# Altium schematic sheet Control_Sense.SchDoc
size A2 portrait; SheetNumber: 2; SheetTotal: 2
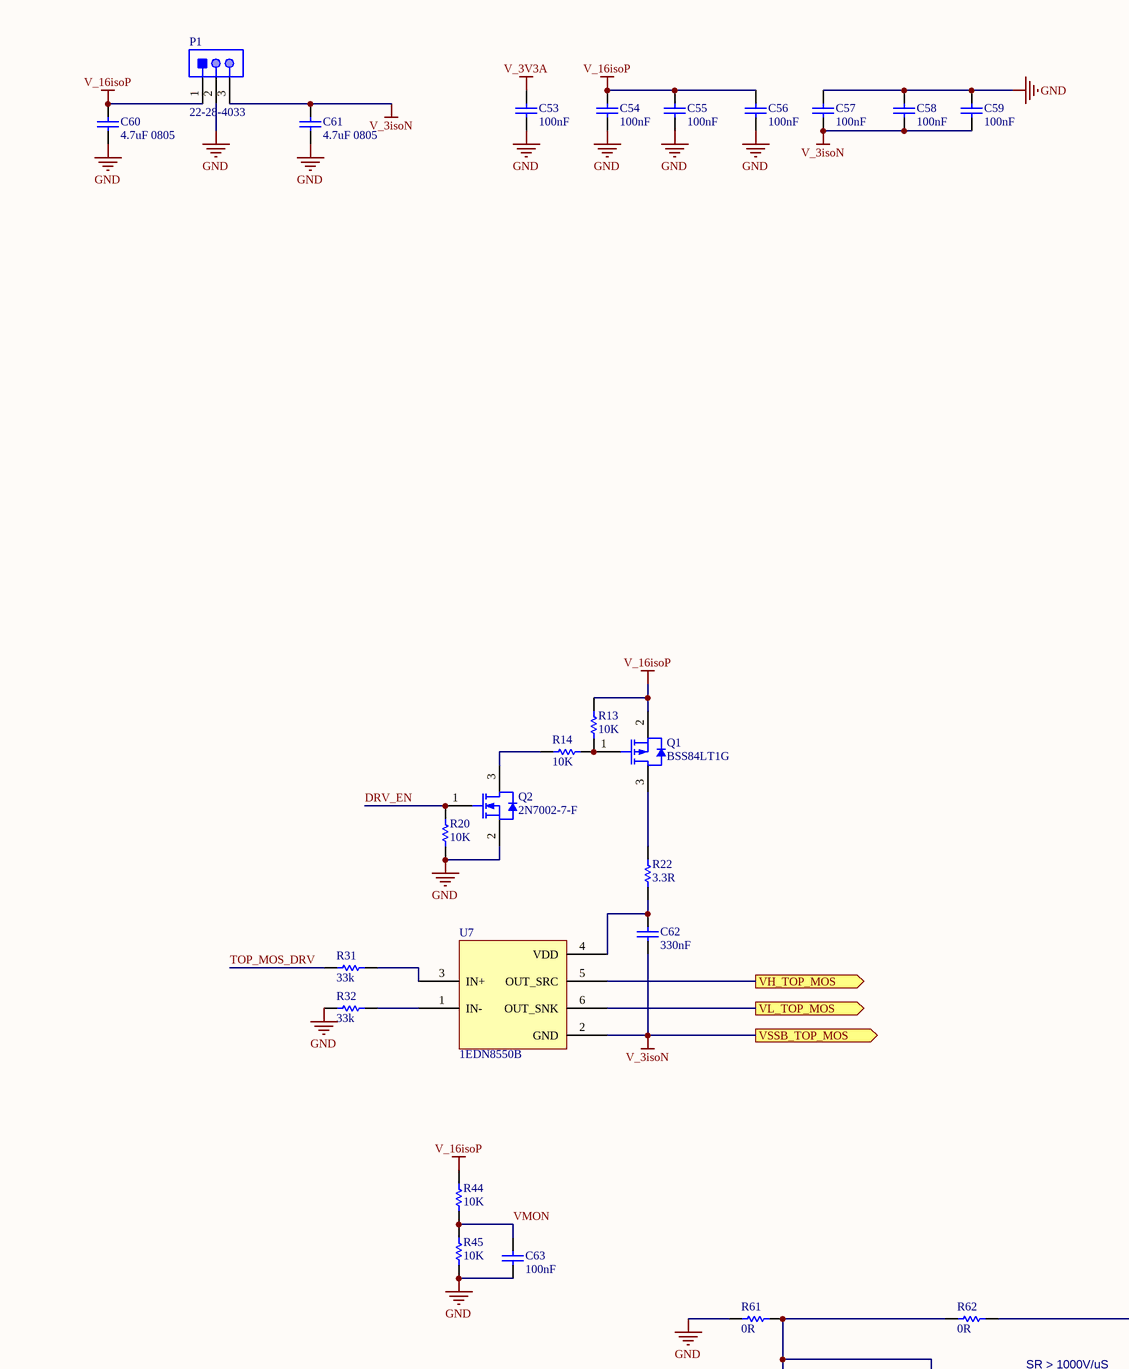
[diagram p0: Control_Sense.SchDoc, top]
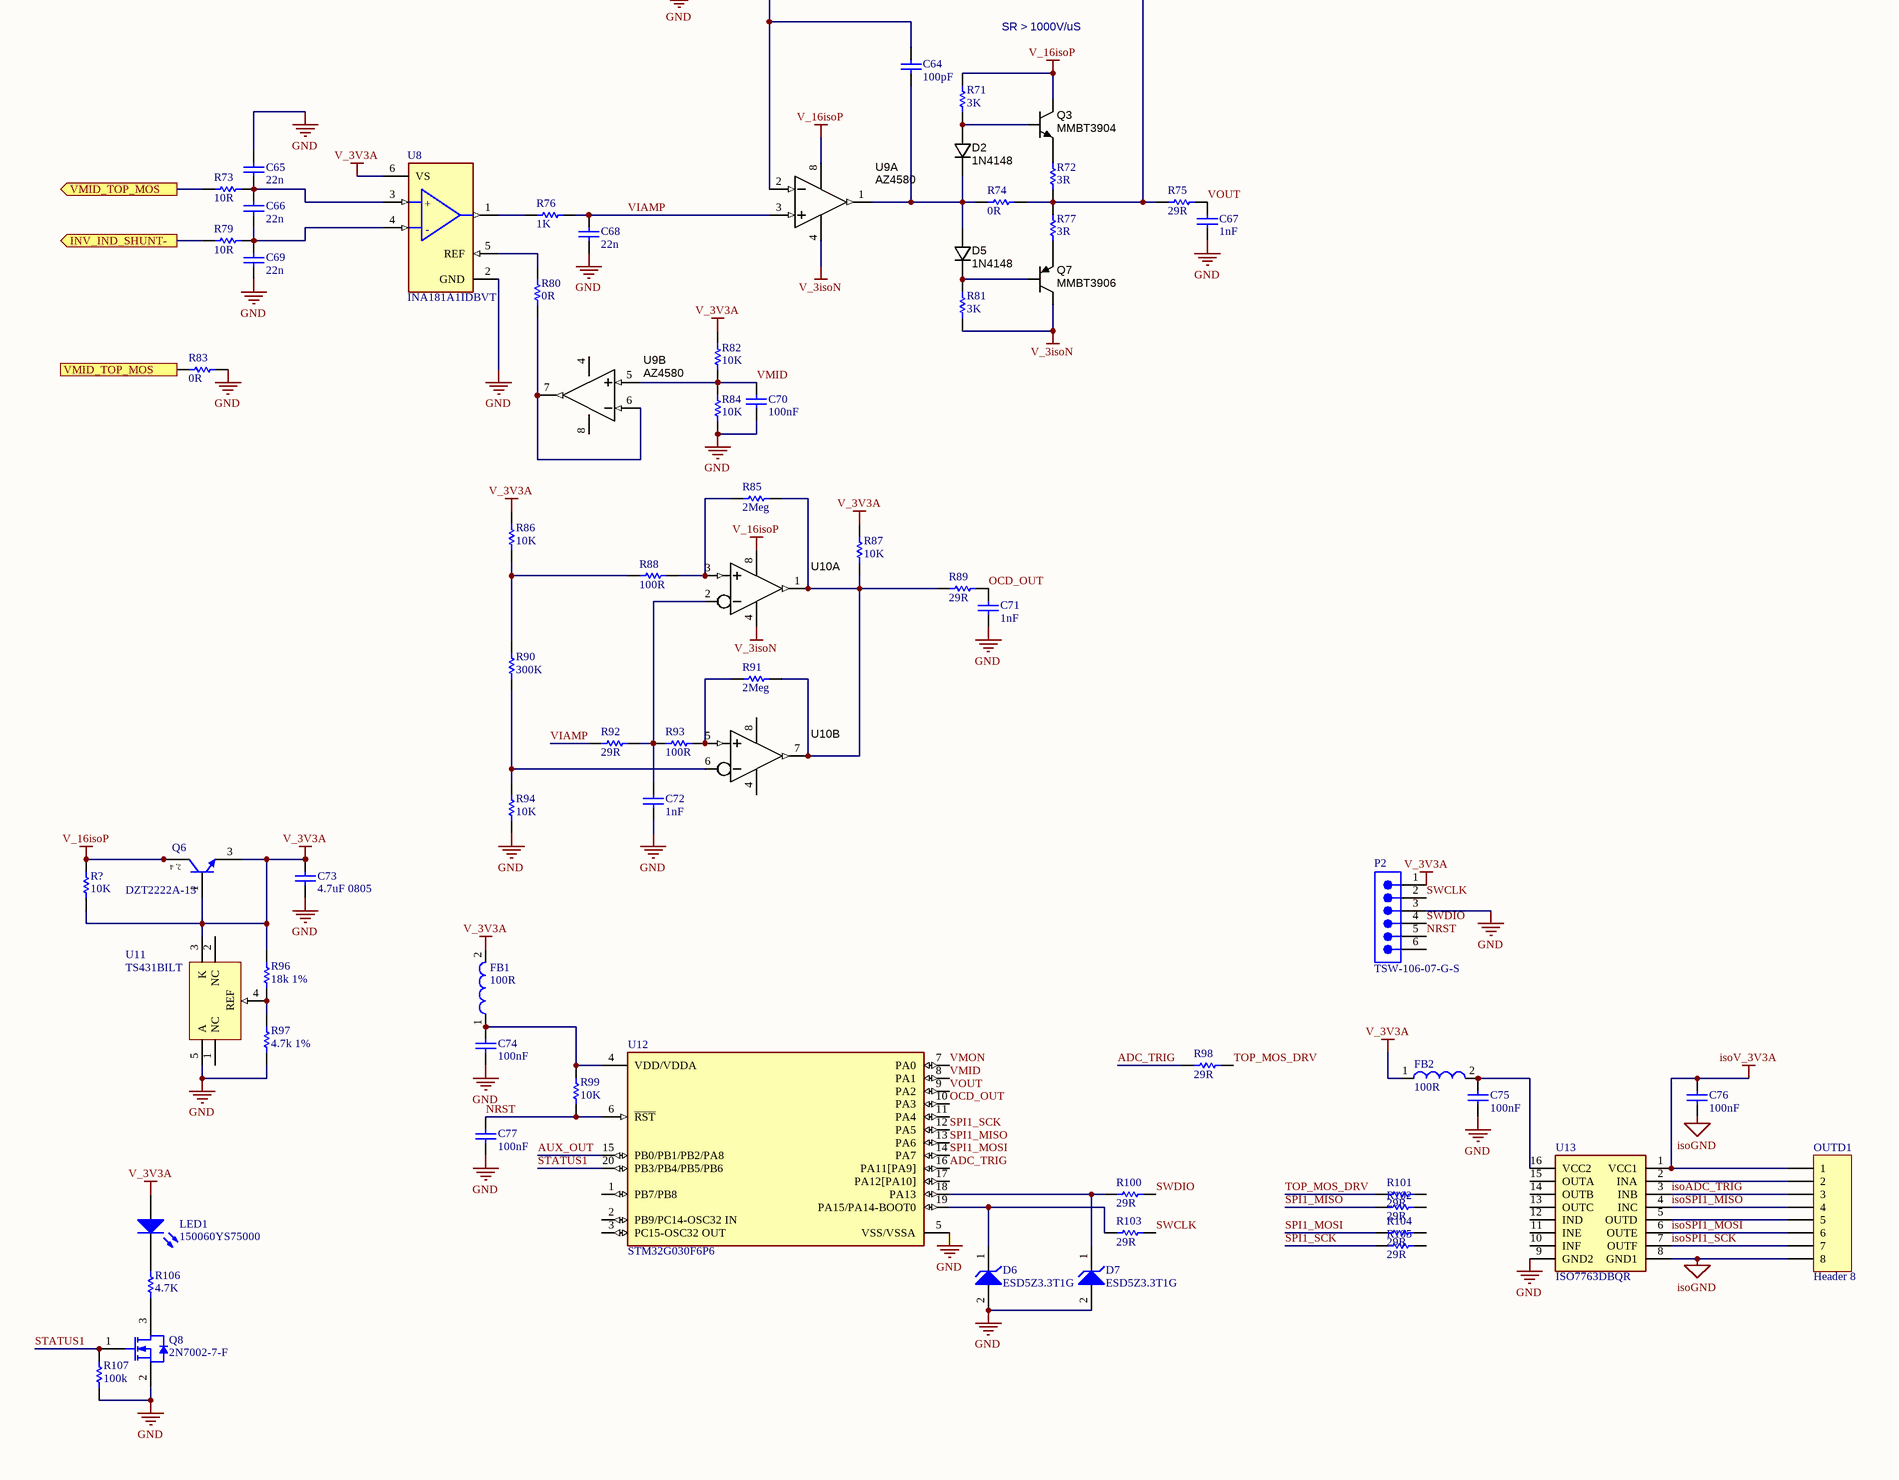
[diagram p1: Control_Sense.SchDoc, bottom]

## Parts
C53  100nF  [CAPC1608X90X35ML15T15]
C54  100nF  [CAPC1608X90X35ML15T15]
C55  100nF  [CAPC1608X90X35ML15T15]
C56  100nF  [CAPC1608X90X35NL15T15]
C57  100nF  [CAPC1608X90X35ML15T15]
C58  100nF  [CAPC1608X90X35ML15T15]
C59  100nF  [CAPC1608X90X35NL15T15]
C60  4.7uF 0805  [CAPC2013X145X20NL20]
C61  4.7uF 0805  [CAPC2013X145X20NL20]
C62  330nF  [CAPC2013X135X45ML10T25]
C63  100nF  [CAPC1608X90X35ML15T15]
C64  100pF  [CAPC1608X90X35ML15T15]
C65  22n  [CAPC2013X135X45ML10T25]
C66  22n  [CAPC2013X135X45ML10T25]
C67  1nF  [CAPC1608X90X35NL15T15]
C68  22n  [CAPC2013X135X45ML10T25]
C69  22n  [CAPC2013X135X45ML10T25]
C70  100nF  [CAPC1608X90X35ML15T15]
C71  1nF  [CAPC1608X90X35NL15T15]
C72  1nF  [CAPC1608X90X35NL15T15]
C73  4.7uF 0805  [CAPC2013X145X20NL20]
C74  100nF  [CAPC1608X90X35NL15T15]
C75  100nF  [CAPC1608X90X35NL15T15]
C76  100nF  [CAPC1608X90X35NL15T15]
C77  100nF  [CAPC1608X90X35NL15T15]
D2  Manufacturer Part Number: 1N4148  [SOD323]  (hidden comment: DIODE_75V_500mW)
D5  Manufacturer Part Number: 1N4148  [SOD323]  (hidden comment: DIODE_75V_500mW)
D6  ESD5Z3.3T1G  [ONSC-SOD-523-2-502-01_V]
D7  ESD5Z3.3T1G  [ONSC-SOD-523-2-502-01_V]
FB1  100R  [SMD-0603]
FB2  100R  [SMD-0603]
LED1  150060YS75000  [0603_A]
OUTD1  Header 8  [HDR1X8]
P1  22-28-4033  [MOLX-22-28-4033_V]
P2  TSW-106-07-G-S  [SMTC-TSW-106-07-X-S]
Q1  BSS84LT1G  [ONSC-SOT-23-3-318-08_V]
Q2  2N7002-7-F  [DIOD-SOT23-3_V]
Q3  Manufacturer Part Number 1: MMBT3904  [SOT23-3]  (hidden comment: NPN_MMBT3904)
Q6  DZT2222A-13  [ONSC-SOT-223-4-318E-04_V]
Q7  Manufacturer Part Number 1: MMBT3906  [SOT23-3]  (hidden comment: PNP_MMBT3906)
Q8  2N7002-7-F  [DIOD-SOT23-3_V]
R13  10K  [RESC1608X55X30NL20T10]
R14  10K  [RESC1608X55X30NL20T10]
R20  10K  [RESC1608X55X30NL20T10]
R22  3.3R  [RESC1608X55X25ML10T15]
R31  33k  [RESC1608X55X25ML10T15]
R32  33k  [RESC1608X55X25ML10T15]
R44  10K  [RESC1608X55X30NL20T10]
R45  10K  [RESC1608X55X30NL20T10]
R61  0R  [RESC1608X55X30NL20T10]
R62  0R  [RESC1608X55X30NL20T10]
R71  3K  [RESC1608X55X30NL20T10]
R72  3R  [RESC1608X55X30NL20T10]
R73  10R  [RESC1608X55X30NL20T10]
R74  0R  [RESC1608X55X30NL20T10]
R75  29R  [RESC1608X55X30NL20T10]
R76  1K  [RESC1608X55X30NL20T10]
R77  3R  [RESC1608X55X30NL20T10]
R79  10R  [RESC1608X55X30NL20T10]
R80  0R  [RESC1608X55X30NL20T10]
R81  3K  [RESC1608X55X30NL20T10]
R82  10K  [RESC1608X55X30NL20T10]
R83  0R  [RESC1608X55X30NL20T10]
R84  10K  [RESC1608X55X30NL20T10]
R85  2Meg  [RESC1608X55X30NL20T10]
R86  10K  [RESC1608X55X30NL20T10]
R87  10K  [RESC1608X55X30NL20T10]
R88  100R  [RESC1608X55X30NL20T10]
R89  29R  [RESC1608X55X30NL20T10]
R90  300K  [RESC1608X55X30NL20T10]
R91  2Meg  [RESC1608X55X30NL20T10]
R92  29R  [RESC1608X55X30NL20T10]
R93  100R  [RESC1608X55X30NL20T10]
R94  10K  [RESC1608X55X30NL20T10]
R96  18k 1%  [RESC1609X55X30NL15T15]
R97  4.7k 1%  [RESC1608X55X30NL15T15]
R98  29R  [RESC1608X55X30NL20T10]
R99  10K  [RESC1608X55X30NL20T10]
R100  29R  [RESC1608X55X30NL20T10]
R101  29R  [RESC1608X55X30NL20T10]
R102  29R  [RESC1608X55X30NL20T10]
R103  29R  [RESC1608X55X30NL20T10]
R104  29R  [RESC1608X55X30NL20T10]
R105  29R  [RESC1608X55X30NL20T10]
R106  4.7K  [RESC1608X55X25ML10T15]
R107  100k  [RESC1608X55X25ML10T15]
R?  10K  [RESC1608X55X30NL20T10]
U7  1EDN8550B  [SOT23-6]
U8  INA181A1IDBVT  [FP-DBV0006A-MFG]
U9  AZ4580  [SOIC127P600X175-8AN]  (parts A,B of 2)
U10  LMC6762  [SOIC127P600X175-8AN]  (value not drawn)  (parts A,B of 2)
U11  TS431BILT  [SOT23-5_N]
U12  STM32G030F6P6  [FP-TSSOP20-YA-MFG]
U13  ISO7763DBQR  [SOP64P600X175-16N]

## Ports
INV_IND_SHUNT- (out), VH_TOP_MOS (out), VL_TOP_MOS (out), VMID_TOP_MOS (out), VSSB_TOP_MOS (out)

## Nets
GND: C53.1 C54.1 C55.1 C56.1 C57.2 C58.2 C59.2 C60.1 C61.1 C63.1 C65.2 C67.1 C68.1 C69.1 C70.1 C71.1 C72.1 C73.1 C74.1 C75.1 C77.1 D6.2(A) D7.2(A) P1.2 P2.3 Q2.2(S) Q8.2(S) R20.2 R32.1 R45.2 R61.1 R83.1 R84.2 R94.1 R97.1 R107.1 U8.2(GND) U11.5(A) U12.5(VSS/VSSA) U13.9(GND2)
isoGND: C76.1 OUTD1.8 U13.8(GND1)
isoV_3V3A: C76.2 OUTD1.1 U13.1(VCC1)
V_3isoN: C57.1 C58.1 C59.1 C61.2 C62.1 P1.3 Q7.3(C) R81.2 U7.2(GND) U9.4(V-) U10.4(V-) ; port VSSB_TOP_MOS
V_3V3A: C53.2 C73.2 FB1.2 FB2.1 LED1.2(A) P2.1 Q6.1(B) Q6.3(E) R82.1 R86.2 R87.1 R96.2 R?.1 U8.6(VS) U11.3(K)
V_16isoP: C54.2 C55.2 C56.2 C60.2 P1.1 Q1.2(S) Q3.3(C) Q6.2(C) Q6.4(C) R13.1 R44.1 R71.1 R?.2 U9.8(V+) U10.8(V+)
ADC_TRIG: R98.1 U12.16(PA11[PA9])
AUX_OUT: U12.15(PB0/PB1/PB2/PA8)
DRV_EN: Q2.1(G) R20.1
INV_IND_SHUNT-: R79.2 ; port INV_IND_SHUNT-
isoADC_TRIG: OUTD1.3 U13.3(INB)
isoSPI1_MISO: OUTD1.4 U13.4(INC)
isoSPI1_MOSI: OUTD1.6 U13.6(OUTE)
isoSPI1_SCK: OUTD1.7 U13.7(OUTF)
NRST: C77.2 P2.5 R99.2 U12.6(~{RST})
OCD_OUT: C71.2 R89.2 U12.10(PA3)
SPI1_MISO: R102.1 U12.13(PA6)
SPI1_MOSI: R104.1 U12.14(PA7)
SPI1_SCK: R105.1 U12.12(PA5)
STATUS1: Q8.1(G) R107.2 U12.20(PB3/PB4/PB5/PB6)
SWCLK: P2.2 R103.2
SWDIO: P2.4 R100.2
TOP_MOS_DRV: R31.1 R98.2 R101.1
VH_TOP_MOS: U7.5(OUT_SRC) ; port VH_TOP_MOS
VIAMP: C68.2 R76.2 R92.1 U9.3(IN+)
VL_TOP_MOS: U7.6(OUT_SNK) ; port VL_TOP_MOS
VMID: C70.2 R82.2 R84.1 U9.5(IN+) U12.8(PA1)
VMID_TOP_MOS: R73.2 R83.2 ; port VMID_TOP_MOS
VMON: C63.2 R44.2 R45.1 U12.7(PA0)
VOUT: C67.2 R75.2 U12.9(PA2)
NetC62_2: C62.2 R22.1 U7.4(VDD)
NetC64_1: C64.1 D2.K D5.A R74.1 U9.1(OUT)
NetC64_2: C64.2 R61.2 R62.1 U9.2(IN-)
NetC65_1: C65.1 C66.2 R73.1 U8.3(IN+)
NetC66_1: C66.1 C69.2 R79.1 U8.4(IN-)
NetC72_2: C72.2 R92.2 R93.1 U10.2(IN_A-)
NetC74_2: C74.2 FB1.1 R99.1 U12.4(VDD/VDDA)
NetC75_2: C75.2 FB2.2 U13.16(VCC2)
NetD2_A: D2.A Q3.1(B) R71.2
NetD5_K: D5.K Q7.1(B) R81.1
NetD6_1: D6.1(K) R103.1 U12.19(PA15/PA14-BOOT0)
NetD7_1: D7.1(K) R100.1 U12.18(PA13)
NetLED1_1: LED1.1(K) R106.2
NetOUTD1_2: OUTD1.2 U13.2(INA)
NetOUTD1_5: OUTD1.5 U13.5(OUTD)
NetQ1_1: Q1.1(G) R13.2 R14.2
NetQ1_3: Q1.3(D) R22.2
NetQ2_3: Q2.3(D) R14.1
NetQ3_2: Q3.2(E) R72.1
NetQ7_2: Q7.2(E) R77.2
NetQ8_3: Q8.3(D) R106.1
NetR31_2: R31.2 U7.3(IN+)
NetR32_2: R32.2 U7.1(IN-)
NetR62_2: R62.2 R72.2 R74.2 R75.1 R77.1
NetR76_1: R76.1 U8.1(OUT)
NetR80_1: R80.1 U8.5(REF)
NetR80_2: R80.2 U9.6(IN-) U9.7(OUT)
NetR85_1: R85.1 R88.2 U10.3(IN_A+)
NetR85_2: R85.2 R87.2 R89.1 R91.2 U10.1(OUT_A) U10.7(OUT_B)
NetR86_1: R86.1 R88.1 R90.2
NetR90_1: R90.1 R94.2 U10.6(IN_B-)
NetR91_1: R91.1 R93.2 U10.5(IN_B+)
NetR96_1: R96.1 R97.2 U11.4(REF)

Not connected (* = marked no-connect by the designer): P2 6; R101 2; R102 2; R104 2; R105 2; U11 1(NC) 2(NC); U12 1(PB7/PB8) 2(PB9/PC14-OSC32_IN) 3(PC15-OSC32_OUT) 11(PA4) 17(PA12[PA10]); U13 10(INF) 11(INE) 12(IND) 13(OUTC) 14(OUTB) 15(OUTA)

## Notes on the sheet
- SR > 1000V/uS
- (in symbol CMP-1048-00517-1) 2, 4
- (in symbol CMP-04895-000046-1) +; -

## Library data of the parts
C53-C59 C63 C67 C70-C72 C74-C77 = CMP-2006-04245-1: Manufacturer: AVX Interconnect / Elco; Part Number: 06035A151JAT2A.; Manufacturer Part Number: 06035A151JAT2A; Dielectric Material: Ceramic; Capacitance: 100pF; Tolerance: 5%; Voltage Rating (DC): 50V; Dielectric: C0G; Temperature Coefficient: 30ppm/°C; Insulation Resistance: 100GR; Supplier 1: Digi-Key; Supplier Part Number 1: 478-1177-1-ND; RoHS: Yes; Category: Ceramic Capacitors; Stock 1: 63714; Pricing 1: 1=0.12000, 10=0.08900, 100=0.04180, 500=0.02932, 1000=0.02428 (USD); Mount: Surface Mount,PCB; Case/Package: 0603; Number of Pins: 2; Case Code (Metric): 1608; Case Code (Imperial): 0603; Contact Plating: Tin,Matte; Min Operating Temperature: -55°C; Max Operating Temperature: 125°C; Voltage Rating: 50V; Packaging: Tape and Reel; Package Quantity: 1; Termination: SMD/SMT; Voltage: 50V; Length: 1.6mm; Height: 0.86mm; Width: 0.032inch; Depth: 0.81mm; Thickness: 0.035inch; Radiation Hardening: No; Lead Free: Lead Free; REACH SVHC: No SVHC; ComponentLink1URL: https://datasheet.ciiva.com/1124/84496-1124721.pdf?src-supplier=Element14; ComponentLink1Description: https://datasheet.ciiva.com/1124/84496-1124721.pdf?src-supplier=Element14; ComponentLink2URL: https://datasheet.ciiva.com/2987/ccog-2987781.pdf?src-supplier=Avnet; ComponentLink2Description: https://datasheet.ciiva.com/2987/ccog-2987781.pdf?src-supplier=Avnet; ComponentLink3URL: https://datasheet.ciiva.com/7855/759117-7855061.pdf?src-supplier=Element14; ComponentLink3Description: https://datasheet.ciiva.com/7855/759117-7855061.pdf?src-supplier=Element14; ComponentLink4URL: https://datasheet.ciiva.com/2987/ccog-2987782.pdf?src-supplier=Avnet; ComponentLink4Description: https://datasheet.ciiva.com/2987/ccog-2987782.pdf?src-supplier=Avnet; ComponentLink5URL: https://datasheet.ciiva.com/156/ccog-156216.pdf?src-supplier=Digi-Key; ComponentLink5Description: https://datasheet.ciiva.com/156/ccog-156216.pdf?src-supplier=Digi-Key; ComponentLink6URL: https://datasheet.ciiva.com/156/ccog-156217.pdf?src-supplier=Digi-Key; ComponentLink6Description: https://datasheet.ciiva.com/156/ccog-156217.pdf?src-supplier=Digi-Key; ComponentLink7URL: https://datasheet.ciiva.com/156/ccog-156218.pdf?src-supplier=Digi-Key; ComponentLink7Description: https://datasheet.ciiva.com/156/ccog-156218.pdf?src-supplier=Digi-Key; ComponentLink8URL: https://datasheet.ciiva.com/16300/ccog-16300429.pdf?src-supplier=Future+Electronics; ComponentLink8Description: https://datasheet.ciiva.com/16300/ccog-16300429.pdf?src-supplier=Future+Electronics; ComponentLink9URL: https://datasheet.ciiva.com/22699/84496-22699966.pdf?src-supplier=Element14; ComponentLink9Description: https://datasheet.ciiva.com/22699/84496-22699966.pdf?src-supplier=Element14; ComponentLink10URL: https://datasheet.ciiva.com/5418/ccog-5418335.pdf?src-supplier=Mouser; ComponentLink10Description: https://datasheet.ciiva.com/5418/ccog-5418335.pdf?src-supplier=Mouser; ComponentLink11URL: https://datasheet.ciiva.com/16538/ccog-16538111.pdf?src-supplier=Avnet+Asia; ComponentLink11Description: https://datasheet.ciiva.com/16538/ccog-16538111.pdf?src-supplier=Avnet+Asia
C60 C61 C73 = CMP-2000-06039-1: Chip Capacitor, 4.7 uF, +/- 10%, 25 V, -55 to 125 degC, 0805 (2012 Metric), RoHS, Tape and Reel; Manufacturer: TDK; PCN Part Number: MLCCPartNumberChange30/Nov/2012; Other Names: 445-5972-2C2012X7R1E475KC2012X7R1E475KT000N; Temperature Coefficient: X7R; Voltage - Rated: 25V; Product Training Modules: CSeriesGeneralApplicationsSEAT,CCV,andTVCLDesignToolsGuidetoReplacinganElectrolyticCapacitorwithanMLCC; Catalog Drawings: CSERIES_2012-0805_1.45; Online Catalog: CSeries,GeneralPurpose; Capacitance: 4.7µF; Package Description: 2-Pin Surface Mount Device, Body 2 x 1.25 mm; Manufacturer URL: http://www.tdk.com/; Features: -; Family: CeramicCapacitors; Applications: GeneralPurpose; Standard Package: 2,000; RoHS Information: RoHSCertificate-MLCC; Operating Temperature: -55°C~125°C; Lead Spacing: -; Lead Style: -; Datasheet Version: 01/2016; Datasheet URL: https://product.tdk.com/info/en/documents/chara_sheet/C2012X7R1E475K125AB.pdf; Series: C; Package Reference: 0805; Category: Capacitors; Ratings: -; Packaging: Tape&Reel(TR); Tolerance: ±10%; Height - Seated (Max): -; Size / Dimension: 0.079"Lx0.049"W(2.00mmx1.25mm); Package / Case: 0805(2012Metric); Mounting Technology: SurfaceMount; Mounting Type: SurfaceMount,MLCC; Thickness (Max): 0.057"(1.45mm)
C62 C65 C66 C68 C69 = CMP-2100-03644-1: Chip Capacitor, 0.1 uF, +/- 10%, 50 V, -55 to 125 degC, 0805 (2012 Metric), RoHS, Tape and Reel; Manufacturer: Murata; Manufacturer Part Number: GRM21BR71H104KA01L; Voltage: 50V; Capacitance: 100nF; Insulation Resistance: 10GR; Dielectric Material: Ceramic; Dielectric: X7R; Package Description: 2-Pin Surface Mount Device, Body 2 x 1.25 mm; Manufacturer URL: http://www.murata.com/; Case Code (Imperial): 0805; Datasheet URL: http://psearch.en.murata.com/capacitor/product/GRM21BR71H104KA01%23.pdf; Termination: SMD/SMT; Lead Free: LeadFree; Package Quantity: 1; Mount: SurfaceMount; REACH SVHC: Unknown; Thickness: 0.053inch; Height: 1.25mm; Case/Package: 0805; Voltage Rating: 50V; Width: 0.049inch; Case Code (Metric): 2012; Material: Ceramic; Min Operating Temperature: -55degC; RoHSCompliant: true; Datasheet Version: 42675.0; Voltage Rating (DC): 50V; Tolerance: 10%; Package Reference: 0805; Depth: 1.25mm; Length: 2mm; Max Operating Temperature: 125degC; Packaging: TapeandReel; Number of Pins: 2; Radiation Hardening: No; Supplier 1: Farnell; Supplier Part Number 1: 2408531; RoHS: Yes; Category: Ceramic Capacitors; ComponentLink1URL: https://datasheet.ciiva.com/11786/0900766b8003061f-11786305.pdf?src-supplier=RSComponents; ComponentLink1Description: https://datasheet.ciiva.com/11786/0900766b8003061f-11786305.pdf?src-supplier=RSComponents; ComponentLink2URL: https://datasheet.ciiva.com/20173/71-2024-20173169.pdf?src-supplier=Rapid+Electronics; ComponentLink2Description: https://datasheet.ciiva.com/20173/71-2024-20173169.pdf?src-supplier=Rapid+Electronics; ComponentLink3URL: https://datasheet.ciiva.com/29200/453120-da-01-en-vs-kondensator-0805-29200537.pdf?src-supplier=Conrad; ComponentLink3Description: https://datasheet.ciiva.com/29200/453120-da-01-en-vs-kondensator-0805-29200537.pdf?src-supplier=Conrad; ComponentLink4URL: https://datasheet.ciiva.com/132/partnumbering-e-01-132209.pdf?src-supplier=Digi-Key; ComponentLink4Description: https://datasheet.ciiva.com/132/partnumbering-e-01-132209.pdf?src-supplier=Digi-Key; ComponentLink5URL: https://datasheet.ciiva.com/132/partnumbering-e-01-132210.pdf?src-supplier=Digi-Key; ComponentLink5Description: https://datasheet.ciiva.com/132/partnumbering-e-01-132210.pdf?src-supplier=Digi-Key; ComponentLink6URL: https://datasheet.ciiva.com/132/partnumbering-e-01-132211.pdf?src-supplier=Digi-Key; ComponentLink6Description: https://datasheet.ciiva.com/132/partnumbering-e-01-132211.pdf?src-supplier=Digi-Key; ComponentLink7URL: https://datasheet.ciiva.com/7937/1794405-7937708.pdf?src-supplier=Element14; ComponentLink7Description: https://datasheet.ciiva.com/7937/1794405-7937708.pdf?src-supplier=Element14; ComponentLink8URL: https://datasheet.ciiva.com/7937/1794405-7937709.pdf?src-supplier=Element14; ComponentLink8Description: https://datasheet.ciiva.com/7937/1794405-7937709.pdf?src-supplier=Element14; ComponentLink9URL: https://datasheet.ciiva.com/28534/1769893-28534317.pdf?src-supplier=Element14; ComponentLink9Description: https://datasheet.ciiva.com/28534/1769893-28534317.pdf?src-supplier=Element14; ComponentLink10URL: https://datasheet.ciiva.com/7937/4360-7937710.pdf?src-supplier=Element14; ComponentLink10Description: https://datasheet.ciiva.com/7937/4360-7937710.pdf?src-supplier=Element14
  C62: Stock 1: 576000
  C65 C66 C68 C69: Stock 1: 555000
C64 = CMP-2006-04245-1: Manufacturer: AVX Interconnect / Elco; Part Number: 06035A151JAT2A.; Manufacturer Part Number: 06035A151JAT2A; Dielectric Material: Ceramic; Tolerance: 5%; Voltage Rating (DC): 50V; Dielectric: C0G; Temperature Coefficient: 30ppm/°C; Insulation Resistance: 100GR; Supplier 1: Digi-Key; Supplier Part Number 1: 478-1177-1-ND; RoHS: Yes; Category: Ceramic Capacitors; Stock 1: 63714; Pricing 1: 1=0.12000, 10=0.08900, 100=0.04180, 500=0.02932, 1000=0.02428 (USD); Mount: Surface Mount,PCB; Case/Package: 0603; Number of Pins: 2; Case Code (Metric): 1608; Case Code (Imperial): 0603; Contact Plating: Tin,Matte; Min Operating Temperature: -55°C; Max Operating Temperature: 125°C; Capacitance: 100pF; Voltage Rating: 50V; Packaging: Tape and Reel; Package Quantity: 1; Termination: SMD/SMT; Voltage: 50V; Length: 1.6mm; Height: 0.86mm; Width: 0.032inch; Depth: 0.81mm; Thickness: 0.035inch; Radiation Hardening: No; Lead Free: Lead Free; REACH SVHC: No SVHC; ComponentLink1URL: https://datasheet.ciiva.com/1124/84496-1124721.pdf?src-supplier=Element14; ComponentLink1Description: https://datasheet.ciiva.com/1124/84496-1124721.pdf?src-supplier=Element14; ComponentLink2URL: https://datasheet.ciiva.com/2987/ccog-2987781.pdf?src-supplier=Avnet; ComponentLink2Description: https://datasheet.ciiva.com/2987/ccog-2987781.pdf?src-supplier=Avnet; ComponentLink3URL: https://datasheet.ciiva.com/7855/759117-7855061.pdf?src-supplier=Element14; ComponentLink3Description: https://datasheet.ciiva.com/7855/759117-7855061.pdf?src-supplier=Element14; ComponentLink4URL: https://datasheet.ciiva.com/2987/ccog-2987782.pdf?src-supplier=Avnet; ComponentLink4Description: https://datasheet.ciiva.com/2987/ccog-2987782.pdf?src-supplier=Avnet; ComponentLink5URL: https://datasheet.ciiva.com/156/ccog-156216.pdf?src-supplier=Digi-Key; ComponentLink5Description: https://datasheet.ciiva.com/156/ccog-156216.pdf?src-supplier=Digi-Key; ComponentLink6URL: https://datasheet.ciiva.com/156/ccog-156217.pdf?src-supplier=Digi-Key; ComponentLink6Description: https://datasheet.ciiva.com/156/ccog-156217.pdf?src-supplier=Digi-Key; ComponentLink7URL: https://datasheet.ciiva.com/156/ccog-156218.pdf?src-supplier=Digi-Key; ComponentLink7Description: https://datasheet.ciiva.com/156/ccog-156218.pdf?src-supplier=Digi-Key; ComponentLink8URL: https://datasheet.ciiva.com/16300/ccog-16300429.pdf?src-supplier=Future+Electronics; ComponentLink8Description: https://datasheet.ciiva.com/16300/ccog-16300429.pdf?src-supplier=Future+Electronics; ComponentLink9URL: https://datasheet.ciiva.com/22699/84496-22699966.pdf?src-supplier=Element14; ComponentLink9Description: https://datasheet.ciiva.com/22699/84496-22699966.pdf?src-supplier=Element14; ComponentLink10URL: https://datasheet.ciiva.com/5418/ccog-5418335.pdf?src-supplier=Mouser; ComponentLink10Description: https://datasheet.ciiva.com/5418/ccog-5418335.pdf?src-supplier=Mouser; ComponentLink11URL: https://datasheet.ciiva.com/16538/ccog-16538111.pdf?src-supplier=Avnet+Asia; ComponentLink11Description: https://datasheet.ciiva.com/16538/ccog-16538111.pdf?src-supplier=Avnet+Asia
D2 D5 = DIODE_75V_500mW: Diode SMD 300mA 0.5W SOD323; Manufacturer: Micro Commercial Co; Ratings: 75V; 300mA; 0.5W; Material: Si; Diode Type: Standard; Value: Vf=1V @ 50mA; SCDType: source; Package / Case: SOD323; Supplier 1: Digi-Key; Supplier Part Number 1: 1N4148WXTPMSCT-ND
D6 D7 = CMP-1063-00098-1: Transient Voltage Suppressor, Micro-Packaged Diode for ESD Protection, 2-Pin SOD-523, Pb-Free, Tape and Reel; Manufacturer: On Semiconductor; VRWM Max (V): 3.3; Number of Lines: 1; V(BR) Min (V): 5; PPK Max (W): 158; Direction: Unidirectional; IR Max (uA): 0.05; PackageReference: SOD-523-2-502-01; PackageVersion: Rev. E, 09/2010; RoHS: Pb-Free; ComponentLink3Description: Package Specification; Packing: Tape and Reel; ComponentLink1URL: http://www.onsemi.com/; DatasheetVersion: Rev. 10; ComponentLink2Description: Datasheet; Mounting Technology: Surface Mount; ComponentLink2URL: http://www.onsemi.cn/pub_link/Collateral/ESD5Z2.5T1-D.PDF; PartNumber: ESD5Z3.3T1G; PackageDescription: 2-Pin SOD, Body 1.2 x 0.8 mm; ComponentLink3URL: http://www.onsemi.com/pub_link/Collateral/502-01.PDF; ComponentLink1Description: Manufacturer URL
FB1 FB2 = CMP-0220-00115-1: SMD EMI Suppression Ferrite Bead WE-CBF, Z = 1500 Ohm; DatasheetVersion: Dec-2005; ComponentLink1URL: http://www.we-online.com; PackageVersion: 2009; PackageDescription: Chip Inductor, 2-Leads, Body 1.6 x 0.8 mm; ComponentLink2URL: http://www.we-online.de/katalog/media/pdf/742792691.pdf; ComponentLink1Description: Manufacturer Link; ComponentLink2Description: Datasheet; Impedance: 1500 Ohm; PackageReference: SMD-0603
LED1 = CMP-1426-00005-1: SMD mono-color Chip LED, WL-SMCW, Yellow; Manufacturer: Wuerth Elektronik; Dominant Wavelength: 590nm; Viewing Angle: 140°; Lens Style: Clear,Rectangular; Luminous Intensity: 120mcd; Forward Voltage: 2V; Forward Current: 30mA; Test Current: 20mA; ComponentLink1URL: http://www.we-online.com; PartNumber: 150060YS75000; Color: Yellow; ComponentLink2Description: Datasheet; ComponentLink2URL: http://katalog.we-online.com/led/datasheet/150060YS75000.pdf; ComponentLink1Description: Manufacturer URL; PackageReference: 0603_A; Supplier 1: Digi-Key; Supplier Part Number 1: 732-4981-1-ND; Manufacturer Part Number: 150060YS75000; RoHS: Yes; Category: LEDs; Stock 1: 139; Pricing 1: 1=0.14000, 50=0.13300, 100=0.11400, 500=0.09900 (USD); Mount: Surface Mount; Case/Package: 0603; Case Code (Imperial): 0603; Case Code (Metric): 1608; Min Operating Temperature: -40°C; Max Operating Temperature: 85°C; Packaging: Tape and Reel; Package Quantity: 4000; Wavelength: 590nm; Length: 1.6mm; Height: 0.7mm; Width: 0.8mm; REACH SVHC: Unknown; ComponentLink3URL: https://datasheet.ciiva.com/23843/150060ys75000-23843250.pdf?src-supplier=Newark; ComponentLink3Description: https://datasheet.ciiva.com/23843/150060ys75000-23843250.pdf?src-supplier=Newark; ComponentLink4URL: https://datasheet.ciiva.com/29279/759432-da-01-en-chipled-0603-w-kl-gelb-150060ys75000-29279206.pdf?src-supplier=Conrad; ComponentLink4Description: https://datasheet.ciiva.com/29279/759432-da-01-en-chipled-0603-w-kl-gelb-150060ys75000-29279206.pdf?src-supplier=Conrad; ComponentLink5URL: https://datasheet.ciiva.com/29563/150060ys75000-29563045.pdf?src-supplier=Digi-Key; ComponentLink5Description: https://datasheet.ciiva.com/29563/150060ys75000-29563045.pdf?src-supplier=Digi-Key; ComponentLink6URL: https://datasheet.ciiva.com/22656/1911348-22656951.pdf?src-supplier=Element14; ComponentLink6Description: https://datasheet.ciiva.com/22656/1911348-22656951.pdf?src-supplier=Element14; ComponentLink7URL: https://datasheet.ciiva.com/29563/150060ys75000-29563033.pdf?src-supplier=Digi-Key; ComponentLink7Description: https://datasheet.ciiva.com/29563/150060ys75000-29563033.pdf?src-supplier=Digi-Key; ComponentLink8URL: https://datasheet.ciiva.com/48430/150060ys75000-eng-tds-48430044.pdf?src-supplier=Distrelec; ComponentLink8Description: https://datasheet.ciiva.com/48430/150060ys75000-eng-tds-48430044.pdf?src-supplier=Distrelec
OUTD1 = Header 8: Header, 8-Pin; LatestRevisionDate: 17-Jul-2002; LatestRevisionNote: Re-released for DXP Platform.; Publisher: Altium Limited
P1 = CMP-1676-00001-5: Male Header, Pitch 2.54 mm, 1 x 3 Position, Height 8.38 mm, Tail Length 3.18 mm, RoHS, Bulk; Manufacturer: Molex; Rows: 1; Voltage Rating: 250 V; Current Rating: 4 A; Min Operating Temperature: 0 degC; Lead Pitch: 0.1 inch; Packaging: Bulk; Contact Finish: Gold; RoHSCompliant: true; Contact Material: Brass; PackageReference: 22-28-4033; REACH SVHC: Unknown; PackageDescription: Male Header, Pitch 2.54 mm, 1 x 3 Position, Height 8.38 mm, Tail Length 3.18 mm; ComponentLink2URL: http://www.molex.com/pdm_docs/sd/022284033_sd.pdf; Height: 8.38 mm; Mounting Technology: Through Hole; ComponentLink1Description: Manufacturer URL; Length: 7.62 mm; Mount: Through Hole; DatasheetVersion: Rev. G, 01/2012; Max Operating Temperature: 75 degC; ComponentLink2Description: Datasheet; Colour: Black; Pins: 3; Contact Plating: Gold; Package Quantity: 1; ComponentLink1URL: http://www.molex.com/
P2 = CMP-1024-00383-1: 0.025" SQ Post Header, Through-hole, Vertical, -55 to 125 degC, 2.54 mm Pitch, 6-Pin, Male, RoHS; Manufacturer: Samtec; Pitch: 2.54 mm; RoHS: True; ComponentLink1Description: Manufacturer URL; DatasheetVersion: F-214; Orientation: Vertical; ComponentLink1URL: http://www.samtec.com; ComponentLink3Description: Package Specification; ComponentLink2Description: Datasheet; PackageVersion: DM, 8/1988; PackageDescription: .025[0.64] SQ. Post Terminal Strip Assembly; PackageReference: TSW-106-07-X-S; Mounting Technology: Through-hole; Temperature Range: -55 to 125 degC; ComponentLink3URL: http://www.samtec.com/documents/webfiles/cpdf/TSW-XXX-XX-XXX-X-XX-XXX-MKT.pdf; ComponentLink2URL: http://www.samtec.com/documents/webfiles/pdf/TSW_TH.PDF; PartNumber: TSW-106-07-G-S
Q1 = CMP-1058-00762-1: Power MOSFET Single P-Channel, -50 V, 10 Ohm, 3-Pin SOT-23, Pb-Free, Tape and Reel; Manufacturer: On Semiconductor; Ciss Typ (pF): 36; ID Max (A): 0.13; Channel Polarity: P Channel; VGS(th) Max (V): 2; VGS Max (V): 20; V(BR)DSS Min (V): 50; Crss Typ (pF): 6.5; PD Max (W): 0.225; Coss Typ (pF): 17; Configuration: Single; Mounting Technology: Surface Mount; ComponentLink3URL: http://www.onsemi.cn/pub_link/Collateral/318-08.PDF; ComponentLink1Description: Manufacturer URL; Package Type: SOT-23-3; ComponentLink2URL: http://www.onsemi.com/pub_link/Collateral/BSS84LT1-D.PDF; RoHS: Pb-Free; Packing: Tape and Reel; ComponentLink1URL: http://www.onsemi.com/; PackageVersion: Rev. AP, 11/2009; PackageReference: SOT-23-3-318-08; PackageDescription: 3-Pin Small Outline Transistor, Body 2.92 x 1.3 mm, Pitch 0.95 mm; DatasheetVersion: Rev. 8; ComponentLink3Description: Package Specification; PartNumber: BSS84LT1G; ComponentLink2Description: Datasheet
Q2 Q8 = CMP-2000-04929-1: N-Channel Enhancement Mode Field Effect Transistor, 60 V, 0.115 A, -55 to 150 degC, 3-Pin SOT23, RoHS, Tape and Reel; Id - Continuous Drain Current: 115mA; Typical Turn-On Delay Time: 7ns; Typical Turn-Off Delay Time: 11ns; Brand: DiodesIncorporated; Transistor Type: 1N-Channel; Vgs - Gate-Source Voltage: 20V; Rise Time: 3ns; Configuration: Single; Fall Time: 5.6ns; Vds - Drain-Source Breakdown Voltage: 70V; Rds On - Drain-Source Resistance: 7.5Ohms; Number of Channels: 1Channel; Forward Transconductance - Min: 0.08S; Pd - Power Dissipation: 300mW; Unit Weight: 0.000282oz; Datasheet URL: http://datasheet.octopart.com/2N7002-7-F-Diodes-Inc.-datasheet-8326113.pdf; Width: 1.3mm; Series: 2N7002; Length: 2.9mm; Product Category: MOSFET; Minimum Operating Temperature: -55C; Manufacturer URL: http://www.diodes.com/; Mounting Style: SMD/SMT; Package Reference: SOT23-3; Package Description: 3-Pin Small Outline Transistor, Body 2.9 x 1.3 mm, Pitch 0.96 mm; Maximum Operating Temperature: +150C; Transistor Polarity: N-Channel; Factory Pack Quantity: 3000; Technology: Si; Channel Mode: Enhancement; Datasheet Version: Rev. 21-2, 02/2009; Type: EnhancementModeFieldEffectTransistor; RoHS: True; Packaging: Reel; Package / Case: SOT-23-3; Height: 1mm; Product: MOSFETSmallSignal; Manufacturer: DiodesIncorporated
Q3 = NPN_MMBT3904: Transistor SMD NPN 40V 0.2A 250mW SOT-23; Manufacturer 1: Fairchild Semiconductor; Ratings: 40V; 200mA; 250mW; Material: Si; SCDType: source; Package / Case: SOT-23; Supplier 1: Digi-Key; Supplier Part Number 1: MMBT3904FSCT-ND; Transistor Type: NPN; Mounting Type: Surface Mount; Supplier 2: Digi-Key; Supplier Part Number 2: 568-1741-1-ND; Manufacturer 2: NXP Semiconductors; Manufacturer Part Number 2: PMBT3904,215; ComponentLink2URL: http://www.nxp.com/documents/data_sheet/PMBT3904.pdf; ComponentLink2Description: http://www.nxp.com/documents/data_sheet/PMBT3904.pdf; ComponentLink1URL: http://www.fairchildsemi.com/ds/MM/MMBT3904.pdf; ComponentLink1Description: http://www.fairchildsemi.com/ds/MM/MMBT3904.pdf
Q6 = CMP-1048-00517-1: NPN Silicon Epitaxial Transistor, 4-Pin SOT-223, Pb-Free, Tape and Reel; PartNumber: BCP56-16T1G; Manufacturer: On Semiconductor; IC Continuous (A): 1; Max Power Dissipation: 1.5W; Collector Emitter Voltage (VCEO): 80V; Max Collector Current: 1A; Collector Base Voltage (VCBO): 100V; Transition Frequency: 130MHz; Emitter Base Voltage (VEBO): 5V; Element Configuration: Single; Collector Emitter Saturation Voltage: 500mV; hFE Min: 25; Mounting Technology: Surface Mount; ComponentLink3Description: Package Specification; Packing: Tape and Reel; PackageVersion: Rev. N, 08/2009; ComponentLink2URL: http://www.onsemi.com/pub_link/Collateral/BCP56T1-D.PDF; ComponentLink1Description: Manufacturer URL; ComponentLink1URL: http://www.onsemi.com/; ComponentLink3URL: http://www.onsemi.com/pub_link/Collateral/318E-04.PDF; Polarity: NPN; PackageDescription: 4-Pin Small Outline Transistor, Body 6.5 x 3.5 mm, Pitch 2.3 mm; PackageReference: SOT-223-4-318E-04; RoHS: TRUE; DatasheetVersion: Rev. 8; ComponentLink2Description: Datasheet; Supplier 1: Digi-Key; Supplier Part Number 1: BCP56-16T1GOSCT-ND; Manufacturer Part Number: BCP56-16T1G; Category: BJTs; Stock 1: 56232; Pricing 1: 1=0.41000, 10=0.30400, 100=0.14440, 500=0.11784 (USD); Case/Package: SOT-223-4; Number of Pins: 4; Contact Plating: Tin,Matte; Min Operating Temperature: -65°C; Max Operating Temperature: 150°C; Packaging: Tape and Reel; Package Quantity: 1000; Collector Emitter Breakdown Voltage: 80V; Max Breakdown Voltage: 80V; Power Dissipation: 1.5W; Gain Bandwidth Product: 130MHz; Number of Elements: 1; Frequency: 130MHz; Voltage Rating (DC): 80V; Current Rating: 1A; Max Frequency: 130MHz; Length: 6.5mm; Height: 1.57mm; Width: 3.5mm; Radiation Hardening: No; Lead Free: Lead Free; REACH SVHC: No SVHC; ComponentLink4URL: https://datasheet.ciiva.com/15139/getdatasheetpartid-110207-15139278.pdf?src-supplier=Verical; ComponentLink4Description: https://datasheet.ciiva.com/15139/getdatasheetpartid-110207-15139278.pdf?src-supplier=Verical; ComponentLink5URL: https://datasheet.ciiva.com/976/bcp56t1-d-976689.pdf?src-supplier=Digi-Key; ComponentLink5Description: https://datasheet.ciiva.com/976/bcp56t1-d-976689.pdf?src-supplier=Digi-Key; ComponentLink6URL: https://datasheet.ciiva.com/976/bcp56t1-d-976690.pdf?src-supplier=Digi-Key; ComponentLink6Description: https://datasheet.ciiva.com/976/bcp56t1-d-976690.pdf?src-supplier=Digi-Key; ComponentLink7URL: https://datasheet.ciiva.com/976/bcp56t1-d-976691.pdf?src-supplier=Digi-Key; ComponentLink7Description: https://datasheet.ciiva.com/976/bcp56t1-d-976691.pdf?src-supplier=Digi-Key; ComponentLink8URL: https://datasheet.ciiva.com/16218/bcp56t1-d-16218471.pdf?src-supplier=Future+Electronics; ComponentLink8Description: https://datasheet.ciiva.com/16218/bcp56t1-d-16218471.pdf?src-supplier=Future+Electronics; ComponentLink9URL: https://datasheet.ciiva.com/16478/bcp56t1-d-16478825.pdf?src-supplier=Avnet+Asia; ComponentLink9Description: https://datasheet.ciiva.com/16478/bcp56t1-d-16478825.pdf?src-supplier=Avnet+Asia; ComponentLink10URL: https://datasheet.ciiva.com/11198/bcp56t1-d-11198028.pdf?src-supplier=Avnet; ComponentLink10Description: https://datasheet.ciiva.com/11198/bcp56t1-d-11198028.pdf?src-supplier=Avnet
Q7 = PNP_MMBT3906: Transistor SMD PNP 40V 0.2A 350mW SOT-23; Manufacturer 1: Fairchild Semiconductor; Ratings: 40V; 200mA; 350mW; Material: Si; Transistor Type: NPN; Vce Saturation (Max) @ Ib, Ic: 400mV @ 5mA, 50mA; DC Current Gain (hFE) (Min) @ Ic, Vce: 100 @ 10mA, 1V; Frequency - Transition: 250MHz; SCDType: spec; Package / Case: SOT-23; Mounting Type: Surface Mount; Supplier 1: Digi-Key; Supplier Part Number 1: MMBT3906FSCT-ND; Supplier Device Package: SOT-23; ComponentLink1URL: http://www.fairchildsemi.com/ds/2N/2N3906.pdf; ComponentLink1Description: http://www.fairchildsemi.com/ds/2N/2N3906.pdf
R13 R14 R20 R44 R45 R61 R62 R71-R77 R79-R94 R98-R105 R? = CMP-2000-01851-1: RK73B1JTTD103J; Manufacturer: KOA Speer; Resistance: 10kR; Tolerance: 5%; Power Rating: 100mW; Temperature Coefficient: 200ppm/°C; Voltage Rating: 50V; Part Number: RK73B1JTTD103J; Supplier 1: Digi-Key; Supplier Part Number 1: 2019-RK73B1JTTD103JCT-ND; Manufacturer Part Number: RK73B1JTTD103J; Stock 1: 652898; Pricing 1: 1=0,10000, 10=0,01500, 100=0,00610, 1000=0,00275, 2500=0,00239 (USD); RoHS: Yes; Case/Package: 0603; Number of Pins: 2; Case Code (Imperial): 0603; Case Code (Metric): 1608; Min Operating Temperature: -55°C; Max Operating Temperature: 155°C; Packaging: Tape and Reel; Composition: Thick Film; Termination: SMD/SMT; Military Standard: Not; Package Quantity: 5000; Voltage Rating (DC): 50V; Length: 1.6mm; Height: 0.45mm; Depth: 0.8mm; Width: 0.8mm; Lead Free: Lead Free; ComponentLink1URL: https://datasheet.ciiva.com/34302/1877832-34302947.pdf?src-supplier=Jameco; ComponentLink1Description: https://datasheet.ciiva.com/34302/1877832-34302947.pdf?src-supplier=Jameco; ComponentLink2URL: https://datasheet.ciiva.com/5554/rk73b-5554408.pdf?src-supplier=Mouser; ComponentLink2Description: https://datasheet.ciiva.com/5554/rk73b-5554408.pdf?src-supplier=Mouser; ComponentLink3URL: https://datasheet.ciiva.com/7773/548635-7773278.pdf?src-supplier=Element14; ComponentLink3Description: https://datasheet.ciiva.com/7773/548635-7773278.pdf?src-supplier=Element14
R22 R31 R32 = CMP-2100-03663-1: Chip Resistor, 100 Ohm, +/- 1%, 0.1 W, -55 to 155 degC, 0603 (1608 Metric), RoHS, Tape and Reel; Manufacturer: Yageo; Manufacturer Part Number: RC0603FR-07100RL; Voltage Rating (DC): 50V; Power Rating: 100mW; Resistance: 100Ohm; Temperature Coefficient: 100ppm/degreesC; Number of Pins: 2; Tolerance: 1%; Height: 0.45mm; Manufacturer URL: http://www.yageo.com/; Military Standard: Not; Datasheet URL: http://www.yageo.com/NewPortal/yageodocoutput?fileName=/pdf/R-Chip/PYu-RC_Group_51_RoHS_L_5.pdf; Case Code (Imperial): 0603; Termination: SMD/SMT; Lead Free: LeadFree; Max Operating Temperature: 155degC; Case Code (Metric): 1608; RoHSCompliant: true; Voltage Rating: 50V; Width: 0.8mm; Composition: ThickFilm; Depth: 0.8mm; REACH SVHC: Unknown; Min Operating Temperature: -55degC; Packaging: TapeandReel; Package Description: 2-Pin Surface Mount Device, Body 1.6 x 0.8 mm; Length: 1.6mm; Package Reference: 0603; Datasheet Version: Rev. 5, 10/2016; Case/Package: 0603; Supplier 1: Digi-Key; Supplier Part Number 1: 311-100HRDKR-ND; RoHS: Yes; Category: Chip SMD Resistors; Stock 1: 21618328; Pricing 1: 1=0.10000, 10=0.02300, 100=0.00940, 1000=0.00421, 2500=0.00366 (USD); ComponentLink1URL: https://datasheet.ciiva.com/7660/38590-7660788.pdf?src-supplier=Element14; ComponentLink1Description: https://datasheet.ciiva.com/7660/38590-7660788.pdf?src-supplier=Element14; ComponentLink2URL: https://datasheet.ciiva.com/11808/0900766b80f96399-11808280.pdf?src-supplier=RSComponents; ComponentLink2Description: https://datasheet.ciiva.com/11808/0900766b80f96399-11808280.pdf?src-supplier=RSComponents; ComponentLink3URL: https://datasheet.ciiva.com/46440/1868787-46440890.pdf?src-supplier=Element14; ComponentLink3Description: https://datasheet.ciiva.com/46440/1868787-46440890.pdf?src-supplier=Element14; ComponentLink4URL: https://datasheet.ciiva.com/7746/1738695-7746237.pdf?src-supplier=Element14; ComponentLink4Description: https://datasheet.ciiva.com/7746/1738695-7746237.pdf?src-supplier=Element14; ComponentLink5URL: https://datasheet.ciiva.com/7746/1738695-7746238.pdf?src-supplier=Element14; ComponentLink5Description: https://datasheet.ciiva.com/7746/1738695-7746238.pdf?src-supplier=Element14; ComponentLink6URL: https://datasheet.ciiva.com/22747/443971-22747518.pdf?src-supplier=Element14; ComponentLink6Description: https://datasheet.ciiva.com/22747/443971-22747518.pdf?src-supplier=Element14
R96 = CMP-2000-07452-1: Chip Resistor, 10 KOhm, +/- 1%, 0.1 W, -55 to 155 degC, 0603 (1608 Metric), RoHS, Tape and Reel; Manufacturer: Panasonic; Voltage Rating: 75V; Case\/Package: 0603; Power Rating: 100mW; Resistance: 10KOhm; Temperature Coefficient: 100ppm\/degreesC; Number of Pins: 2; Package Reference: 603; Depth: 0.8mm; Mount: SurfaceMount; Package Description: 2-Pin Surface Mount Device, Body 1.6 x 0.85 mm; Datasheet Version: 02/2017; Length: 1.6mm; Lead Free: LeadFree; Height: 0.45mm; Number of Terminations: 2; Max Power Dissipation: 100mW; Min Operating Temperature: -55degC; Datasheet URL: https://industrial.panasonic.com/cdbs/www-data/pdf/RDA0000/AOA0000C304.pdf; Termination: SMD/SMT; Case Code (Metric): 1608; Case Code (Imperial): 0603; Tolerance: 1%; Max Operating Temperature: 155degC; RoHSCompliant: true; Voltage Rating (DC): 75V; Radiation Hardening: No; Packaging: TapeandReel; Composition: ThickFilm; Mounting Technology: SurfaceMount; Manufacturer URL: http://www.panasonic.com/; Width: 0.031inch; REACH SVHC: NoSVHC; Contact Plating: Tin; Military Standard: Not; Package Quantity: 1
R97 = CMP-2000-00271-1: Manufacturer: Panasonic; Part Number: ERJ-3EKF1602V
R106 = CMP-1659-00035-1: General Purpose Chip Resistor, 470 Ohm, +/- 1%, -55 to 155 degC, 0603 (1608 Metric), RoHS, Tape and Reel; Manufacturer: Yageo; Manufacturer Part Number: RC0603FR-07470RL; Impedance: 50 Ohm; Power Rating: 100mW; Temperature Coefficient: 100ppm/°C; Voltage Rating: 50V; Working Voltage: 75V; Fastening Type: Snap; Min Operating Temperature: -40 degC; Length: 3 mm; PackageReference: 0603; Contact Material: Brass; Max Operating Temperature: 90 degC; ComponentLink2URL: https://datasheet.ciiva.com/11808/0900766b80f96399-11808177.pdf; Packaging: Tape and Reel; DatasheetVersion: Rev. 4, 04/2009; Contact Plating: Gold; Radiation Hardening: No; Height: 1.25 mm; Resistance: 50 Ohm; RoHSCompliant: true; ComponentLink2Description: Datasheet; Package Quantity: 2500; ComponentLink1URL: http://www.yageo.com/; Width: 3.1 mm; Mount: Surface Mount; PackageDescription: 2-Pin Surface Mount Device, Body 1.6 x 0.8 mm; ComponentLink1Description: Manufacturer URL; Supplier 1: Digi-Key; Supplier Part Number 1: 311-470HRCT-ND; RoHS: Yes; Category: Chip SMD Resistors; Stock 1: 4373564; Pricing 1: 1=0.10000, 10=0.02300, 100=0.00940, 1000=0.00421, 2500=0.00366 (USD); Case/Package: 0603; Case Code (Metric): 1608; Case Code (Imperial): 0603; Tolerance: 1%; Termination: SMD/SMT; Composition: Thick Film; Number of Terminations: 2; Max Power Dissipation: 100mW; Military Standard: Not; Features: Moisture Resistant; Depth: 0.8mm; REACH SVHC: No SVHC; Lead Free: Lead Free; ComponentLink3URL: https://datasheet.ciiva.com/11808/0900766b80f96399-11808177.pdf?src-supplier=RSComponents; ComponentLink3Description: https://datasheet.ciiva.com/11808/0900766b80f96399-11808177.pdf?src-supplier=RSComponents; ComponentLink4URL: https://datasheet.ciiva.com/7660/1868787-7660793.pdf?src-supplier=Element14; ComponentLink4Description: https://datasheet.ciiva.com/7660/1868787-7660793.pdf?src-supplier=Element14; ComponentLink5URL: https://datasheet.ciiva.com/46440/1868787-46440907.pdf?src-supplier=Element14; ComponentLink5Description: https://datasheet.ciiva.com/46440/1868787-46440907.pdf?src-supplier=Element14; ComponentLink6URL: https://datasheet.ciiva.com/2454/pyu-r-int-thick-7-2454014.pdf?src-supplier=Digi-Key; ComponentLink6Description: https://datasheet.ciiva.com/2454/pyu-r-int-thick-7-2454014.pdf?src-supplier=Digi-Key; ComponentLink7URL: https://datasheet.ciiva.com/7746/1738695-7746359.pdf?src-supplier=Element14; ComponentLink7Description: https://datasheet.ciiva.com/7746/1738695-7746359.pdf?src-supplier=Element14; ComponentLink8URL: https://datasheet.ciiva.com/7746/1738695-7746360.pdf?src-supplier=Element14; ComponentLink8Description: https://datasheet.ciiva.com/7746/1738695-7746360.pdf?src-supplier=Element14; ComponentLink9URL: https://datasheet.ciiva.com/2454/pyu-r-int-thick-7-2454012.pdf?src-supplier=Digi-Key; ComponentLink9Description: https://datasheet.ciiva.com/2454/pyu-r-int-thick-7-2454012.pdf?src-supplier=Digi-Key; ComponentLink10URL: https://datasheet.ciiva.com/2454/pyu-r-int-thick-7-2454013.pdf?src-supplier=Digi-Key; ComponentLink10Description: https://datasheet.ciiva.com/2454/pyu-r-int-thick-7-2454013.pdf?src-supplier=Digi-Key
R107 = CMP-2000-06953-1: General Purpose Chip Resistor, 1 MOhm, +/- 5%, -55 to 155 degC, 0603 (1608 Metric), RoHS, Tape and Reel; Manufacturer: Yageo; Manufacturer Part Number: RC0603JR-071ML; Power Rating: 100mW; Product Range: RCSeries; Temperature Coefficient: ±100ppm/°C; Resistor Element Type: ThickFilm; Resistance: 1Mohm; SVHC: ToBeAdvised; Voltage Rating: 50V; Resistor Case Style: 0603[1608Metric]; MSL: MSL1-Unlimited; Package Description: 2-Pin Surface Mount Device, Body 1.6 x 0.8 mm; Resistance Tolerance: ±5%; Datasheet Version: Rev. 7, 05/2017; Datasheet URL: http://www.yageo.com/documents/recent/PYu-RC_Group_51_RoHS_L_7.pdf; Manufacturer URL: http://www.yageo.com/; Package Reference: 0603; Automotive Qualification Standard: -; Packaging: CutTape; Mounting Technology: SurfaceMount; Supplier 1: Digi-Key; Supplier Part Number 1: 311-1.0MGRCT-ND; Stock 1: 3949362; Pricing 1: 1=0,10000, 10=0,01900, 100=0,00770, 1000=0,00347, 2500=0,00301 (USD); RoHS: Yes; Case/Package: 0603; Number of Pins: 2; Case Code (Imperial): 0603; Case Code (Metric): 1608; Contact Plating: Tin,Matte; Min Operating Temperature: -55°C; Max Operating Temperature: 155°C; Tolerance: 5%; Composition: Thick Film; Termination: SMD/SMT; Package Quantity: 5000; Military Standard: Not; Voltage Rating (DC): 50V; Length: 1.6mm; Height: 0.45mm; Width: 0.8mm; Depth: 0.8mm; Radiation Hardening: No; Lead Free: Lead Free; REACH SVHC: No SVHC; ComponentLink1URL: https://datasheet.ciiva.com/46395/443971-46395067.pdf?src-supplier=Element14; ComponentLink1Description: https://datasheet.ciiva.com/46395/443971-46395067.pdf?src-supplier=Element14; ComponentLink2URL: https://datasheet.ciiva.com/8883/pyu-rc0603-51-rohs-l-4-8883053.pdf?src-supplier=Avnet; ComponentLink2Description: https://datasheet.ciiva.com/8883/pyu-rc0603-51-rohs-l-4-8883053.pdf?src-supplier=Avnet; ComponentLink3URL: https://datasheet.ciiva.com/12555/rc0603-272842-12555342.pdf?src-supplier=Mouser; ComponentLink3Description: https://datasheet.ciiva.com/12555/rc0603-272842-12555342.pdf?src-supplier=Mouser; ComponentLink4URL: https://datasheet.ciiva.com/7746/443971-7746463.pdf?src-supplier=Element14; ComponentLink4Description: https://datasheet.ciiva.com/7746/443971-7746463.pdf?src-supplier=Element14
U7 = 1EDN8550B: Single-channel EiceDRIVER™ with true  differential inputs /
U8 = CMP-04895-000046-1: IC CURR SENSE 1 CIRCUIT SOT23-6; Manufacturer: Texas Instruments; Standoff Height: 0mm; Bandwidth: 350kHz; Min Supply Voltage: 2.7V; Number Of Channels: 1; Output Current Per Channel: 8mA; Nominal Supply Current: 195uA; Input Offset Voltage: 0.1mV; Max Supply Voltage: 5.5V; Input Bias Current: 75uA; Max Junction Temp: +150°C; Octopart: https://octopart.com/ina181a1idbvt-texas+instruments-81856290; ComponentLink2URL: http://www.ti.com/lit/ds/symlink/ina181.pdf; RoHS: TRUE; ComponentLink2Description: Datasheet; Digikey Description: IC CURR SENSE 1 CIRCUIT SOT23-6; Automotive: No; Lead Free: Yes; Package: DBV0006A; Manufacturer Part Number: INA181A1IDBVT; Temperature Range Low: -40°C; Temperature Range High: +125°C; Height: 1.45mm; Device Class L1: Integrated Circuits (ICs); Device Class L3: Instrumentation; Device Class L2: Linear ICs; Ambient Temperature Range High: +125°C; Category: IC; Ambient Temperature Range Low: -40°C; Temperature: -40°C to +125°C
U9 = IC_Op-Amp_AD8512: IC SMD Low Cost Op Amp SOIC-8; Manufacturer 1: Analog Devices Inc; Manufacturer Part Number 1: AD8512BRZ; Voltage - Supply: 2.7 V ~ 16 V, ±1.35 V ~ 8 V; SCDType: spec?; Package / Case: 8-SOIC (0.154", 3.90mm Width); Supplier 1: Digi-Key; Supplier Part Number 1: AD8512BRZ-ND
U10 = IC_COMP_2CH_LMC6762: IC Dual Rail-Rail PP Comparator SOIC-8 SMD; Manufacturer 1: National Semiconductor; Manufacturer Part Number 1: LMC6762BIM/NOPB; Voltage - Supply: 2.7 V ~ 16 V, ±1.35 V ~ 8 V; Number of Elements: 2; Output Type: Push-Pull, Rail-to-Rail; SCDType: spec; Package / Case: 8-SOIC (0.154", 3.90mm Width); Supplier 1: Digi-Key; Supplier Part Number 1: LMC6762BIM-ND; ComponentLink1URL: http://www.ti.com/lit/ds/symlink/lmc6762.pdf; ComponentLink1Description: http://www.ti.com/lit/ds/symlink/lmc6762.pdf
U11 = CMP-0242-00042-1: 30mA, Low voltage adjustable shunt reference, 1.24 to 6V, 5-Pin SOT23-5, Tape and Reel; ComponentLink1URL: http://www.st.com; ComponentLink1Description: Manufacturer URL; ComponentLink2URL: http://www.st.com/internet/com/TECHNICAL_RESOURCES/TECHNICAL_LITERATURE/DATASHEET/CD00001336.pdf; PackageVersion: 2010; ComponentLink2Description: Datasheet; PackageReference: SOT23-5; PackageDescription: 5-Pin SOT-23 Package, 2.9 x 1.6 mm Body, 0.95 mm Pitch, 2.8 mm Lead Span; DatasheetVersion: Aug-2010
U12 = CMP-12105-000034-1: ARM MICROCONTROLLERS - MCU; Manufacturer: STMicroelectronics; Max Supply Voltage: 3.6V; Interface: I2C,SPI,USART,LIN,IrDA,I2S,SMBus; Memory Size: 32KBytes; Number Of I/Os: 17; Number Of Timers/Counters: 6; Core Architecture: ARM Cortex-M0+; Number Of Pwm Channels: 11; Standoff Height: 0.05mm; Number Of A/D Converters: 1; Number Of I2C Channels: 2; Data Bus Width: 32bits; Ram Size: 8KBytes; Max Junction Temp: +105°C; Number Of Spi Channels: 3; Min Supply Voltage: 2V; Number Of Adc Channels: 16; Memory Type: FLASH; Frequency: 64MHz; Ambient Temperature Range Low: -40°C; ComponentLink2URL: https://www.st.com/resource/en/datasheet/stm32g030f6.pdf; Temperature Range Low: -40°C; Automotive: No; Device Class L1: Integrated Circuits (ICs); Category: IC; Temperature Range High: +85°C; ComponentLink2Description: Datasheet; Device Class L2: Embedded Processors and Controllers; Manufacturer Part Number: STM32G030F6P6; Height: 1.2mm; Ambient Temperature Range High: +85°C; Octopart: https://octopart.com/stm32g030f6p6-stmicroelectronics-103773023; Package: TSSOP20-YA; Temperature: -40°C to +85°C; Lead Free: Yes; Device Class L3: Microcontrollers; Number Of Uart Channels: 2; RoHS: TRUE; Number Of Cores: 1; Digikey Description: ARM MICROCONTROLLERS - MCU
U13 = ISO7763DBQR: Integrated Circuit; Manufacturer_Name: Texas Instruments; Datasheet Link: https://www.ti.com/lit/ds/symlink/iso7760.pdf?HQS=TI-null-null-digikeymode-df-pf-null-wwe&ts=1596786476211; Height: 1.75mm; Manufacturer_Part_Number: ISO7763DBQR; Mouser Part Number: 595-ISO7763DBQR; Mouser Price/Stock: https://www.mouser.co.uk/ProductDetail/Texas-Instruments/ISO7763DBQR?qs=rrS6PyfT74e9DmG18dTYMA%3D%3D; Arrow Part Number: ISO7763DBQR; Arrow Price/Stock: https://www.arrow.com/en/products/iso7763dbqr/texas-instruments